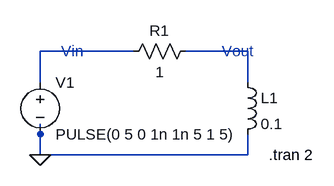
[diagram p0: schematic RL circuit.asc]
RL circuit.asc, the LTspice schematic file:
Version 4.1
SHEET 1 880 680
WIRE 176 80 32 80
WIRE 352 80 256 80
WIRE 32 128 32 80
WIRE 352 128 352 80
WIRE 32 208 32 192
WIRE 32 240 32 208
WIRE 352 240 352 208
WIRE 352 240 32 240
FLAG 32 240 0
SYMBOL voltage 32 112 R0
WINDOW 123 0 0 Left 0
WINDOW 39 0 0 Left 0
SYMATTR InstName V1
SYMATTR Value PULSE(0 5 0 1n 1n 5 1 5)
SYMBOL res 272 64 R90
WINDOW 0 0 56 VBottom 2
WINDOW 3 32 56 VTop 2
SYMATTR InstName R1
SYMATTR Value 1
SYMBOL ind 336 112 R0
SYMATTR InstName L1
SYMATTR Value 0.1
TEXT 64 80 Left 2 ;Vin
TEXT 312 80 Left 2 ;Vout
TEXT 384 240 Left 2 !.tran 2

The netlist it stands for:
* RL circuit.asc
V1 N001 0 PULSE(0 5 0 1n 1n 5 1 5)
R1 N002 N001 1
L1 N002 0 0.1
* Vin
* Vout
.tran 2
.backanno
.end